# EAGLE schematic target (EAGLE 7.0.0)
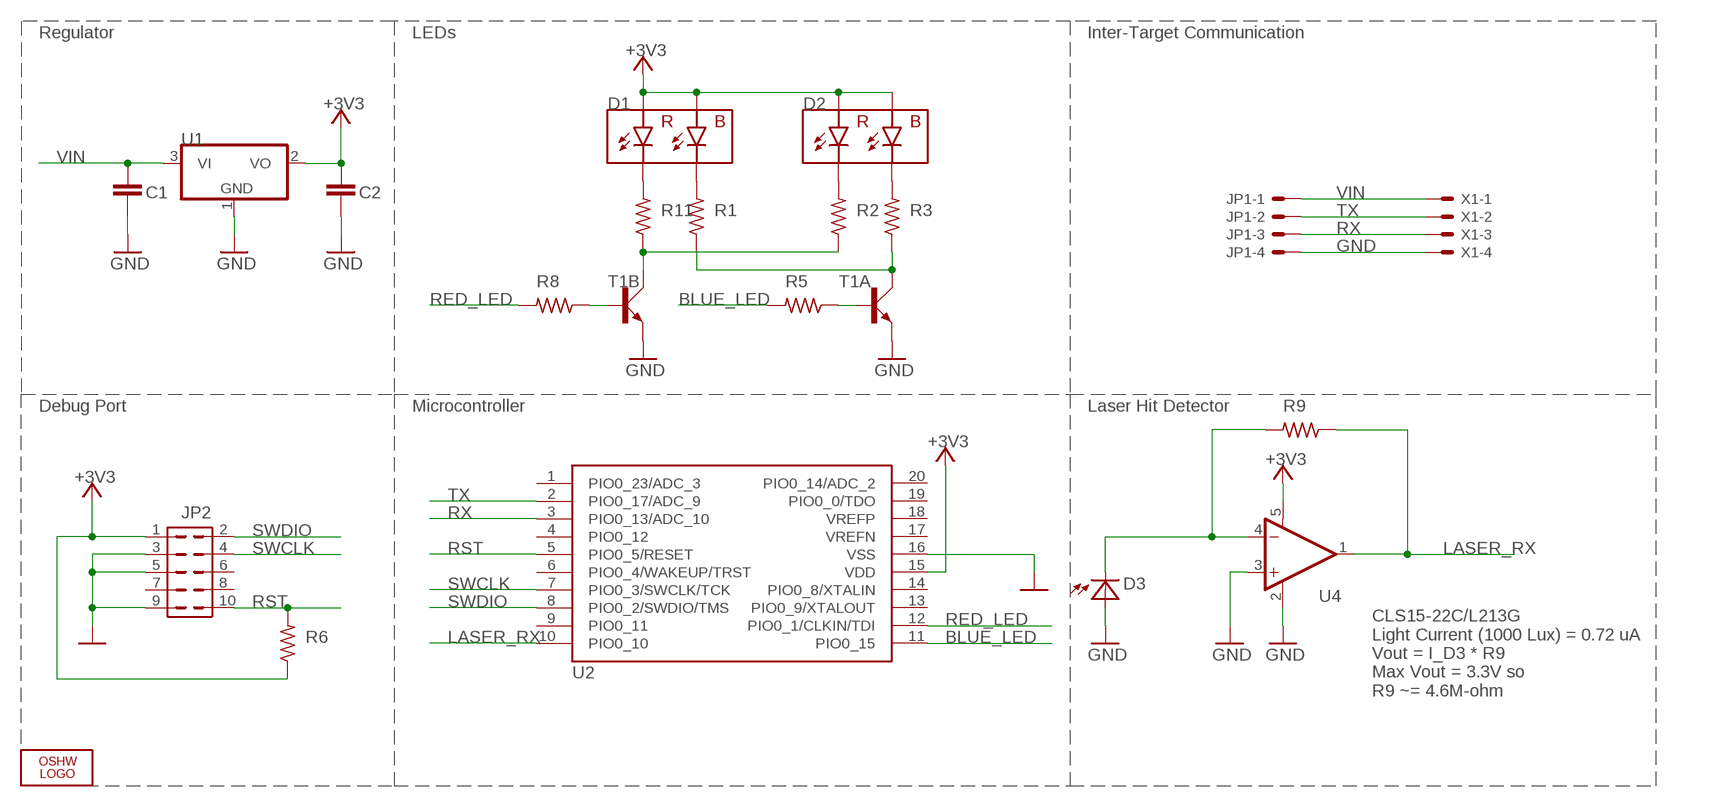
[diagram p0: schematic, sheet 1]

## Parts
C1  C1608X5R1C106M080AB  CAP0603-CAP  [0603-CAP]
C2  C1608X5R1C106M080AB  CAP0603-CAP  [0603-CAP]
D1  150141RB73100  LED_RB  [150141RB]
D2  150141RB73100  LED_RB  [150141RB]
D3  638-CLS1522CL213GTR8  CLS15CLS15  [CLS15]
JP1  798-DF134P125V20  53398-04  [53398-04]
JP2  FTSH-105-01-L  FTSH-105  [FTSH-105-01-XXX-DV-K]
LOGO2  OSHW_LOGO_FILLX0150-NT  [OSHW_FILLX150_NOTEXT]
R1  71-CRCW0603-5.6-E3  R-US_R0603  [R0603]
R2  71-CRCW060368R0FKEB  R-US_R0603  [R0603]
R3  71-CRCW0603-5.6-E3  R-US_R0603  [R0603]
R5  71-CRCW0603220RFKEB  R-US_R0603  [R0603]
R6  71-CRCW0603-10K-E3  R-US_R0603  [R0603]
R8  71-CRCW0603220RFKEB  R-US_R0603  [R0603]
R9  71-CRCW06034M64FKEA  R-US_R0603  [R0603]
R11  71-CRCW060368R0FKEB  R-US_R0603  [R0603]
T1  771-BC847BS-T/R  BC847BS  [SOT363_PHILIPS]
U1  579-MCP1703T-3002ECB  MCP1703CB  [SOT23]
U2  771-LPC824M201JDH20J  LPC824  [TSSOP20]
U4  579-MCP6291T-E/OT  MCP6291T-E/OT  [SOT23-5]
X1  798-DF134P125V20  53398-04  [53398-04]

## Nets
+3V3: C2.1 D1.1 D1.2 D2.1 D2.2 JP2.1 R6.1 U1.2(VO) U2.15(VDD) U4.5(V+)
BLUE_LED: R5.2 U2.11(PIO0_15)
GND: C1.2 C2.2 D3.1(A) D3.2(A) JP1.4 JP2.3 JP2.5 JP2.9 T1.1(A:E) T1.4(B:E) U1.1(GND) U2.16(VSS) U4.2(V-) U4.3(+IN) X1.4
LASER_RX: R9.1 U2.10(PIO0_10) U4.1(OUT)
N$1: R1.1 R3.1 T1.6(A:C)
N$2: R2.1 R11.1 T1.3(B:C)
N$3: D1.3 R11.2
N$4: R5.1 T1.2(A:B)
N$5: D3.3(C) D3.4(C) R9.2 U4.4(-IN)
N$6: D2.3 R2.2
N$7: D1.4 R1.2
N$8: D2.4 R3.2
N$11: R8.1 T1.5(B:B)
RED_LED: R8.2 U2.12(PIO0_1/CLKIN/TDI)
RST: JP2.10 R6.2 U2.5(PIO0_5/RESET)
RX: JP1.3 U2.3(PIO0_13/ADC_10) X1.3
SWCLK: JP2.4 U2.7(PIO0_3/SWCLK/TCK)
SWDIO: JP2.2 U2.8(PIO0_2/SWDIO/TMS)
TX: JP1.2 U2.2(PIO0_17/ADC_9) X1.2
VIN: C1.1 JP1.1 U1.3(VI) X1.1
Unconnected: JP2.6 JP2.7 JP2.8 U2.1(PIO0_23/ADC_3) U2.4(PIO0_12) U2.6(PIO0_4/WAKEUP/TRST) U2.9(PIO0_11) U2.13(PIO0_9/XTALOUT) U2.14(PIO0_8/XTALIN) U2.17(VREFN) U2.18(VREFP) U2.19(PIO0_0/TDO) U2.20(PIO0_14/ADC_2)

## Notes on the sheet
- Regulator | LEDs | Inter-Target Communication
- Debug Port | Microcontroller | Laser Hit Detector
- CLS15-22C/L213G
  Light Current (1000 Lux) = 0.72 uA
  Vout = I_D3 * R9
  Max Vout = 3.3V so
  R9 ~= 4.6M-ohm

## Library data of the parts
C1 C2 = SparkFun-Passives:CAP: Capacitor Standard 0603 ceramic capacitor, and 0.1" leaded capacitor.
D1 D2 = torpedo:LED_RB
D3 = torpedo:CLS15
JP1 X1 = con-molex:53?-04: CONNECTOR wire to board 1.25 mm (.049 inch) pitch header; OC_FARNELL: 1125367; OC_NEWARK: unknown
JP2 = torpedo:FTSH-105
LOGO2 = ohw-logo:OSHW_LOGO_FILL
R1-R3 R5 R6 R8 R9 R11 = rcl:R-US_: RESISTOR, American symbol
T1 = transistor-small-signal:BC847BS: NPN general purpose double transistor Source: http://www.farnell.com/datasheets/2466.pdf
U1 = linear:MCP1703: 250 mA, 16V, Low Quiescent Current LDO Regulator Source: http://ww1.microchip.com/downloads/en/DeviceDoc/22049b.pdf
U2 = torpedo:LPC824
U4 = SparkFun-AnalogIC:MCP6291: Rail to rail OpAmp with 10MHz GBP; PROD_ID: IC-11991